# Altium schematic sheet [01]POWER.SchDoc
size C
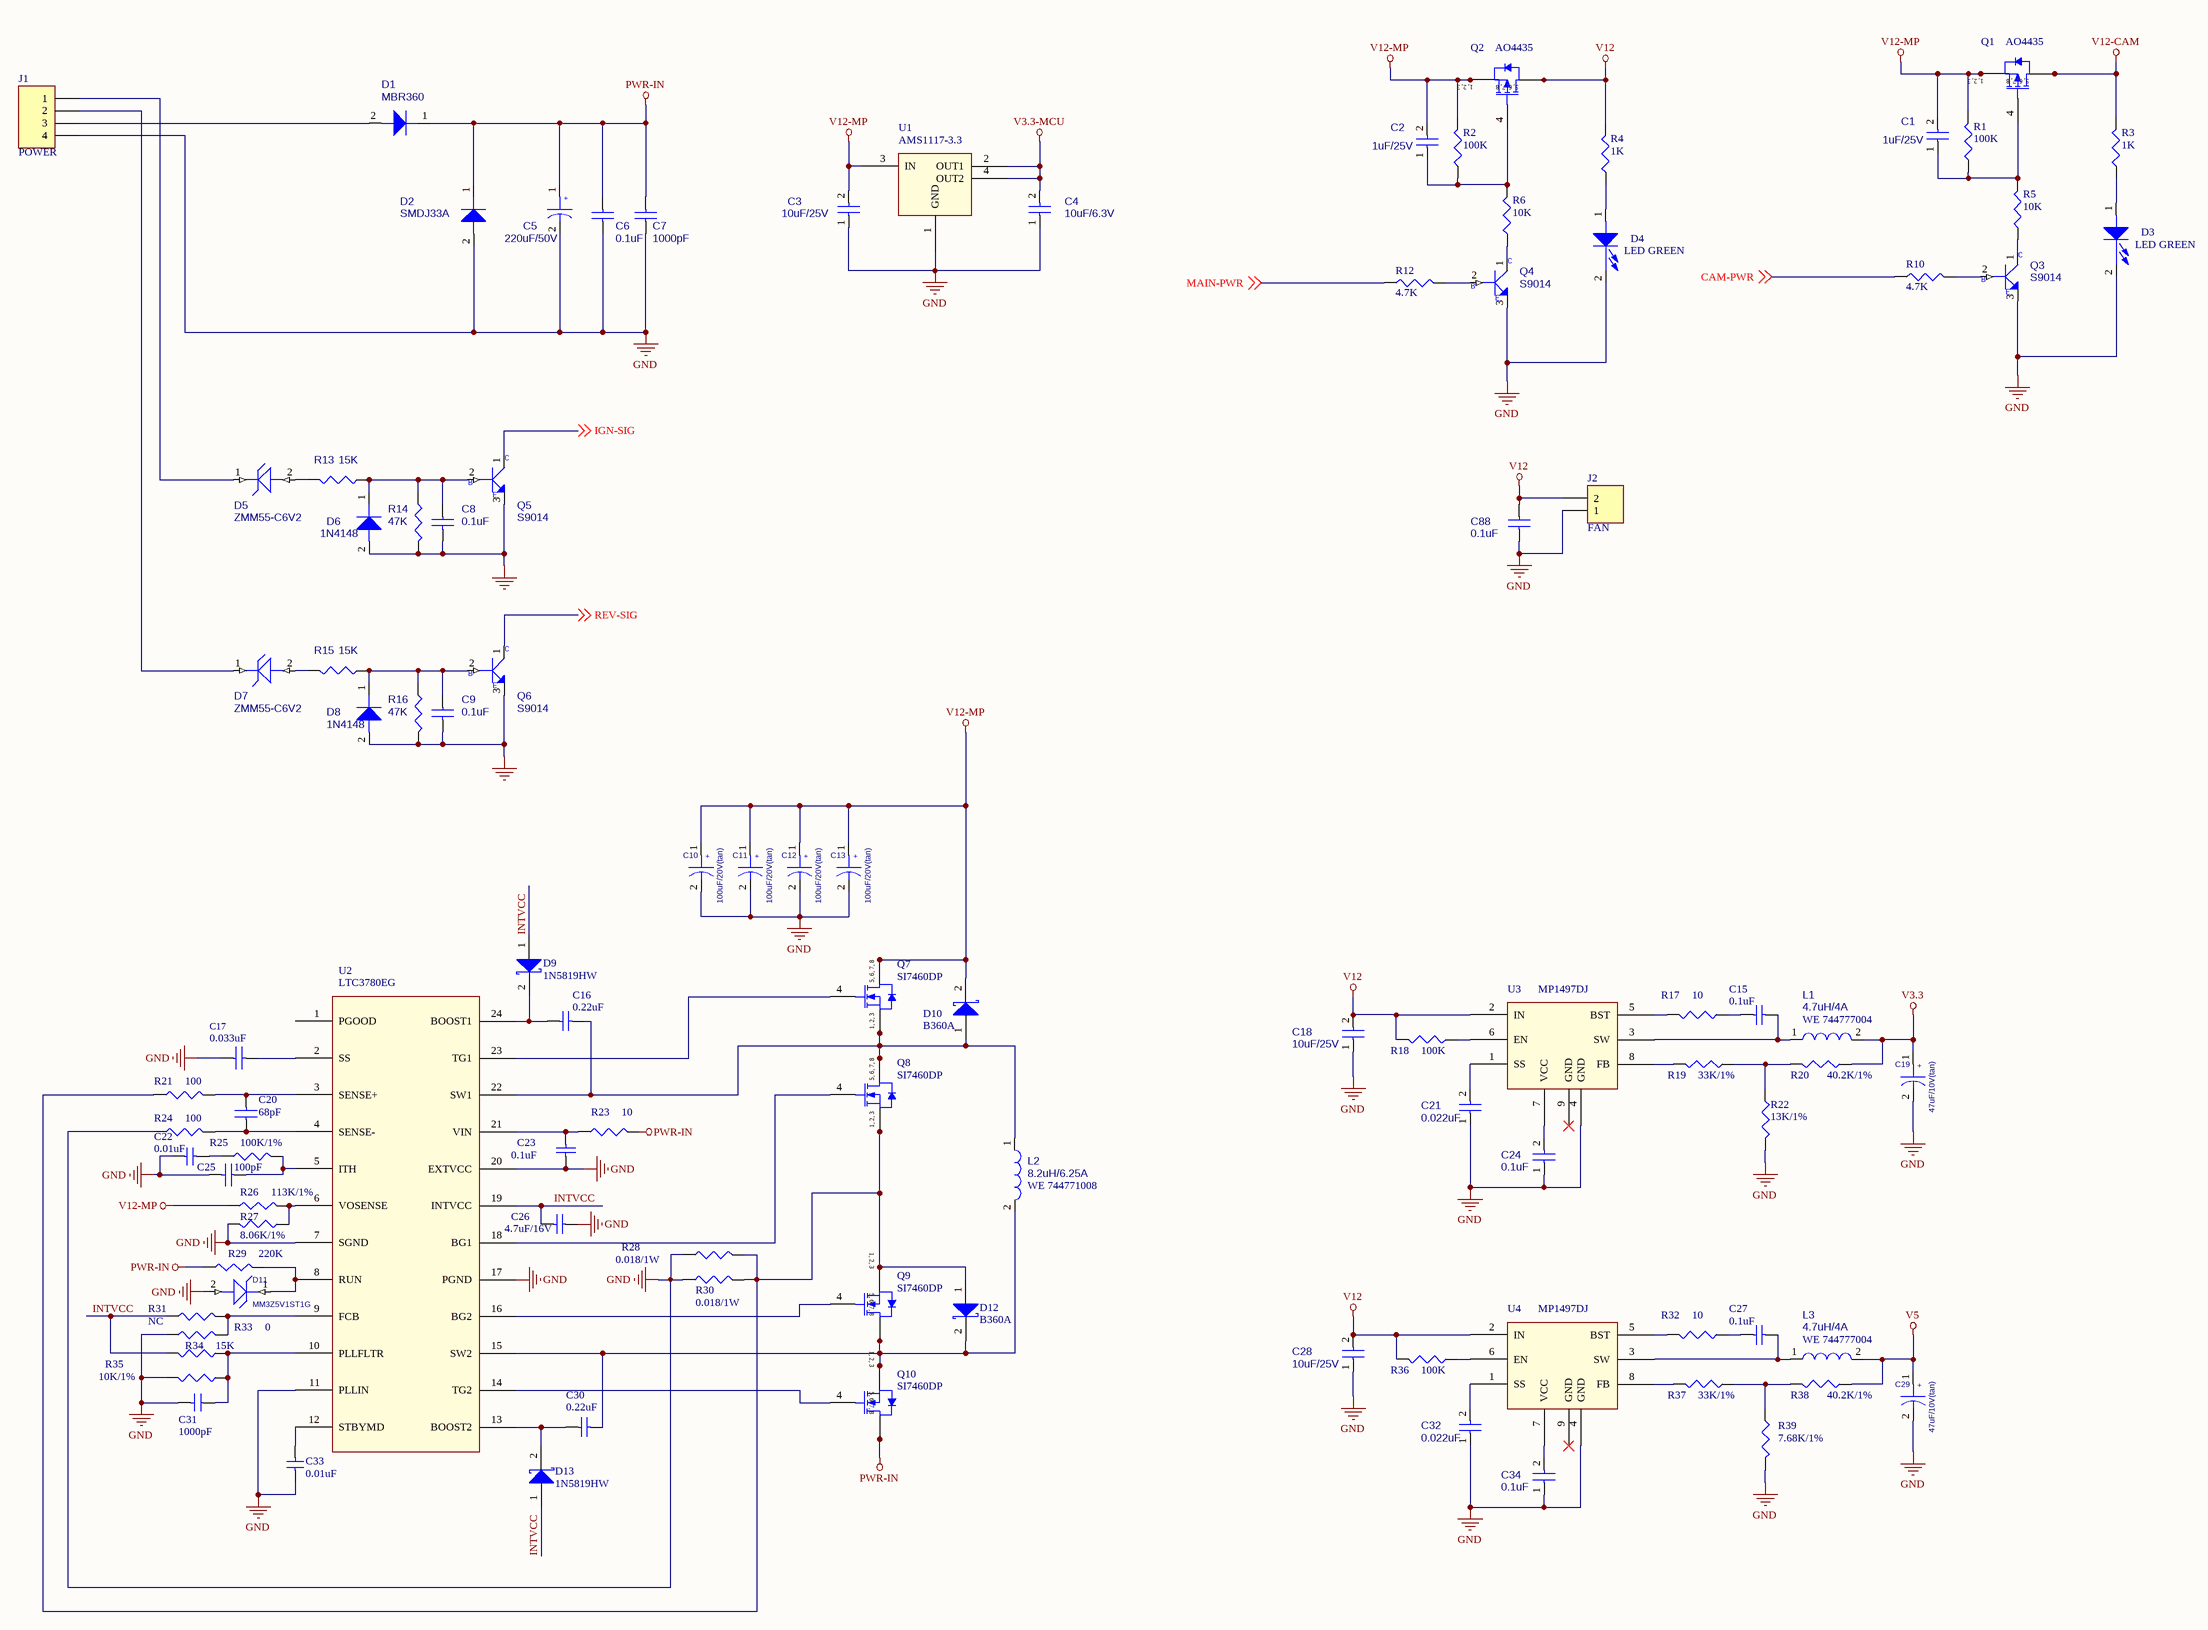
[diagram p0: [01]POWER.SchDoc]

## Parts
C1  1uF/25V  [0805]
C2  1uF/25V  [0805]
C3  10uF/25V  [1812]
C4  10uF/6.3V  [0805]
C5  220uF/50V  [DL-10*10.5]
C6  0.1uF  [0603]
C7  1000pF  [0603]
C8  0.1uF  [0603]
C9  0.1uF  [0603]
C10  100uF/20V(tan)  [7343]
C11  100uF/20V(tan)  [7343]
C12  100uF/20V(tan)  [7343]
C13  100uF/20V(tan)  [7343]
C15  0.1uF  [0603]
C16  0.22uF  [0603]
C17  0.033uF  [0603]
C18  10uF/25V  [1812]
C19  47uF/10V(tan)  [3528]
C20  68pF  [0603]
C21  0.022uF  [0603]
C22  0.01uF  [0603]
C23  0.1uF  [0603]
C24  0.1uF  [0603]
C25  100pF  [0603]
C26  4.7uF/16V  [0805]
C27  0.1uF  [0603]
C28  10uF/25V  [1812]
C29  47uF/10V(tan)  [3528]
C30  0.22uF  [0603]
C31  1000pF  [0603]
C32  0.022uF  [0603]
C33  0.01uF  [0603]
C34  0.1uF  [0603]
C88  0.1uF  [0603]
D1  MBR360  [DO214AB]
D2  SMDJ33A  [DO214AB]
D3  LED GREEN  [LED0603]
D4  LED GREEN  [LED0603]
D5  ZMM55-C6V2  [MINI-MELF]
D6  1N4148  [MINI-MELF]
D7  ZMM55-C6V2  [MINI-MELF]
D8  1N4148  [MINI-MELF]
D9  1N5819HW  [1N5819]
D10  B360A  [B320A]
D11  MM3Z5V1ST1G  [MM3Z5V1ST1G]
D12  B360A  [B320A]
D13  1N5819HW  [1N5819]
J1  POWER  [5557-4PIN]
J2  FAN  [XH2.0-2P-SMD]
L1  4.7uH/4A  code: WE 744777004  [IND-4.7UH-4A]
L2  8.2uH/6.25A  code: WE 744771008  [IND-8.2UH-10A]
L3  4.7uH/4A  code: WE 744777004  [IND-4.7UH-4A]
Q1  AO4435  [SO8]
Q2  AO4435  [SO8]
Q3  S9014  [NPN]
Q4  S9014  [NPN]
Q5  S9014  [NPN]
Q6  S9014  [NPN]
Q7  SI7460DP  [POWERPAK]
Q8  SI7460DP  [POWERPAK]
Q9  SI7460DP  [POWERPAK]
Q10  SI7460DP  [POWERPAK]
R1  100K  [0603]
R2  100K  [0603]
R3  1K  [0603]
R4  1K  [0603]
R5  10K  [0603]
R6  10K  [0603]
R10  4.7K  [0603]
R12  4.7K  [0603]
R13  15K  [0603]
R14  47K  [0603]
R15  15K  [0603]
R16  47K  [0603]
R17  10  [0603]
R18  100K  [0603]
R19  33K/1%  [0603]
R20  40.2K/1%  [0603]
R21  100  [0603]
R22  13K/1%  [0603]
R23  10  [0603]
R24  100  [0603]
R25  100K/1%  [0603]
R26  113K/1%  [0603]
R27  8.06K/1%  [0603]
R28  0.018/1W  [2512]
R29  220K  [0603]
R30  0.018/1W  [2512]
R31  NC  [0603]
R32  10  [0603]
R33  0  [0603]
R34  15K  [0603]
R35  10K/1%  [0603]
R36  100K  [0603]
R37  33K/1%  [0603]
R38  40.2K/1%  [0603]
R39  7.68K/1%  [0603]
U1  AMS1117-3.3  [AMS1117]
U2  LTC3780EG  [LTC3780EG]
U3  MP1497DJ  [TSOT23-8]
U4  MP1497DJ  [TSOT23-8]

## Nets
GND: C3.1 C4.1 C5.2 C6.1 C7.1 C8.2 C9.2 C10.2 C11.2 C12.2 C13.2 C17.1 C18.1 C19.2 C21.1 C22.1 C23.1 C24.1 C25.2 C26.2 C28.1 C29.2 C31.2 C32.1 C33.1 C34.1 C88.1 D2.2 D3.2(CATHODE) D4.2(CATHODE) D6.2 D8.2 D11.2 J1.4 J2.1 Q3.3(EMITTER) Q4.3(EMITTER) Q5.3(EMITTER) Q6.3(EMITTER) R14.2 R16.2 R22.2 R24.1 R27.2 R28.1 R30.1 R33.1 R35.2 R39.2 U1.1(GND) U2.7(SGND) U2.11(PLLIN) U2.17(PGND) U2.20(EXTVCC) U3.4(GND) U4.4(GND)
PWR-IN: C5.1 C6.2 C7.2 D1.1 D2.1 Q10.5(D) Q10.6(D) Q10.7(D) Q10.8(D) R23.2 R29.1
V3.3: C19.1 L1.2 R20.1
V3.3-MCU: C4.2 U1.2(OUT1) U1.4(OUT2)
V5: C29.1 L3.2 R38.1
V12: C18.2 C28.2 C88.2 J2.2 Q2.5(D) Q2.6(D) Q2.7(D) Q2.8(D) R4.2 R18.2 R36.2 U3.2(IN) U4.2(IN)
V12-CAM: Q1.5(D) Q1.6(D) Q1.7(D) Q1.8(D) R3.2
V12-MP: C1.2 C2.2 C3.2 C10.1 C11.1 C12.1 C13.1 D10.2(K) Q1.1(S) Q1.2(S) Q1.3(S) Q2.1(S) Q2.2(S) Q2.3(S) Q7.5(D) Q7.6(D) Q7.7(D) Q7.8(D) R1.2 R2.2 R26.1 U1.3(IN)
CAM-PWR: R10.1 ; off-sheet CAM-PWR
IGN-SIG: Q5.1(COLLECTOR) ; off-sheet IGN-SIG
INTVCC: C26.1 D9.1(A) D13.1(A) R31.1 R34.2 U2.19(INTVCC)
MAIN-PWR: R12.1 ; off-sheet MAIN-PWR
REV-SIG: Q6.1(COLLECTOR) ; off-sheet REV-SIG
NetC1_1: C1.1 Q1.4(G) R1.1 R5.2
NetC2_1: C2.1 Q2.4(G) R2.1 R6.2
NetC8_1: C8.1 D6.1 Q5.2(BASE) R13.1 R14.1
NetC9_1: C9.1 D8.1 Q6.2(BASE) R15.1 R16.1
NetC15_1: C15.1 L1.1 U3.3(SW)
NetC15_2: C15.2 R17.1
NetC16_1: C16.1 D10.1(A) L2.1 Q7.1(S) Q7.2(S) Q7.3(S) Q8.5(D) Q8.6(D) Q8.7(D) Q8.8(D) U2.22(SW1)
NetC16_2: C16.2 D9.2(K) U2.24(BOOST1)
NetC17_2: C17.2 U2.2(SS)
NetC20_1: C20.1 R24.2 U2.4(SENSE-)
NetC20_2: C20.2 R21.2 U2.3(SENSE+)
NetC21_2: C21.2 U3.1(SS)
NetC22_2: C22.2 R25.1
NetC23_2: C23.2 R23.1 U2.21(VIN)
NetC24_2: C24.2 U3.7(VCC)
NetC25_1: C25.1 R25.2 U2.5(ITH)
NetC27_1: C27.1 L3.1 U4.3(SW)
NetC27_2: C27.2 R32.1
NetC30_1: C30.1 D12.2(K) L2.2 Q9.5(D) Q9.6(D) Q9.7(D) Q9.8(D) Q10.1(S) Q10.2(S) Q10.3(S) U2.15(SW2)
NetC30_2: C30.2 D13.2(K) U2.13(BOOST2)
NetC31_1: C31.1 R34.1 R35.1 U2.10(PLLFLTR)
NetC32_2: C32.2 U4.1(SS)
NetC33_2: C33.2 U2.12(STBYMD)
NetC34_2: C34.2 U4.7(VCC)
NetD1_2: D1.2 J1.3
NetD3_1: D3.1(ANODE) R3.1
NetD4_1: D4.1(ANODE) R4.1
NetD5_1: D5.1 J1.1
NetD5_2: D5.2 R13.2
NetD7_1: D7.1 J1.2
NetD7_2: D7.2 R15.2
NetD11_1: D11.1 R29.2 U2.8(RUN)
NetD12_1: D12.1(A) Q8.1(S) Q8.2(S) Q8.3(S) Q9.1(S) Q9.2(S) Q9.3(S) R21.1 R28.2 R30.2
NetQ3_1: Q3.1(COLLECTOR) R5.1
NetQ3_2: Q3.2(BASE) R10.2
NetQ4_1: Q4.1(COLLECTOR) R6.1
NetQ4_2: Q4.2(BASE) R12.2
NetQ7_4: Q7.4(G) U2.23(TG1)
NetQ8_4: Q8.4(G) U2.18(BG1)
NetQ9_4: Q9.4(G) U2.16(BG2)
NetQ10_4: Q10.4(G) U2.14(TG2)
NetR17_2: R17.2 U3.5(BST)
NetR18_1: R18.1 U3.6(EN)
NetR19_1: R19.1 R20.2 R22.1
NetR19_2: R19.2 U3.8(FB)
NetR26_2: R26.2 R27.1 U2.6(VOSENSE)
NetR31_2: R31.2 R33.2 U2.9(FCB)
NetR32_2: R32.2 U4.5(BST)
NetR36_1: R36.1 U4.6(EN)
NetR37_1: R37.1 R38.2 R39.1
NetR37_2: R37.2 U4.8(FB)

Not connected (* = marked no-connect by the designer): U2 1(PGOOD); U3 9(GND)*; U4 9(GND)*

## Notes on the sheet
- (in symbol CAP WP) +
- (in symbol MMBT3904_NL_SOT23-3) C; B; E
- (in symbol SI4410DY) 1, 2, 3; 5, 6, 7, 8
- (in symbol SI4431DY) 1, 2, 3; 5, 6, 7, 8

## Library data of the parts
C1-C4 C6 C7 C18 C21 C24 C28 C32 C34 C88 = CAP NP_Dup2
C5 C10-C13 C19 C29 = CAP WP
C8 C9 = CAP
C15 C16 C23 C26 C27 C30 = Cap: Capacitor
C17 C20 = 06033C223KAT1A_0
C22 = 06033C103KAT2A
C25 = 06035A470KAT1A_0
C31 C33 = 06033C103KAT2A_0
D1 D2 D6 D8 = 1N4148WS-7-F_SOD323-2
D3 D4 = LN01401_1
D5 D7 D11 = MMGZ5231BPTLL34
D9 D10 D12 D13 = Diode 11DQ03: Schottky Rectifier
J1 = Header 4: Header, 4-Pin
J2 = Header 2: Header, 2-Pin; LatestRevisionDate: 17-Jul-2002; LatestRevisionNote: Re-released for DXP Platform.; Publisher: Altium Limited
L1-L3 = 4.7UH_CDH2D09BNP-4R7MC_0.7A_20%
Q1 Q2 = SI4431DY: P-Channel 30V (D-S)  MOSFET; Published: 8-Jun-2000; LatestRevisionDate: 13-Apr-2006; LatestRevisionNote: IPC-7351 Footprint Added.; DatasheetVersion: 6-Oct-1997; PackageVersion: Aug-1998; PackageReference: SO-8; Publisher: Altium Limited; PackageDescription: 8-Pin Small Outline Integrated Circuit 1.27 mm Pitch; ComponentLink1Description: Manufacturer Link; ComponentLink1URL: http://www.vishay.com/; ComponentLink2Description: Datasheet; ComponentLink2URL: http://www.vishay.com/docs/70151/70151.pdf
Q3-Q5 = MMBT3904_NL_SOT23-3: Part Description: S TR MMBT3904_NL NPN SOT23; Part Number: SB039040000
Q6 = MMBT3904_NL_SOT23-3
Q7-Q10 = SI4410DY: N-Channel 30V (D-S)  MOSFET
R1-R6 R10 R12 R17-R20 R22 R23 R25 R28 R30-R39 = CR16-1003FM
R13-R16 = R
R21 R24 = CR16-1241FM
R26 = CR16-1133FM
R27 = CR16-8061FM
R29 = CR16-224JM
U1 = LT1963EST-1_4.8
U3 U4 = MP1482_5